# EAGLE design SlaveV1 (EAGLE 6.5.0)
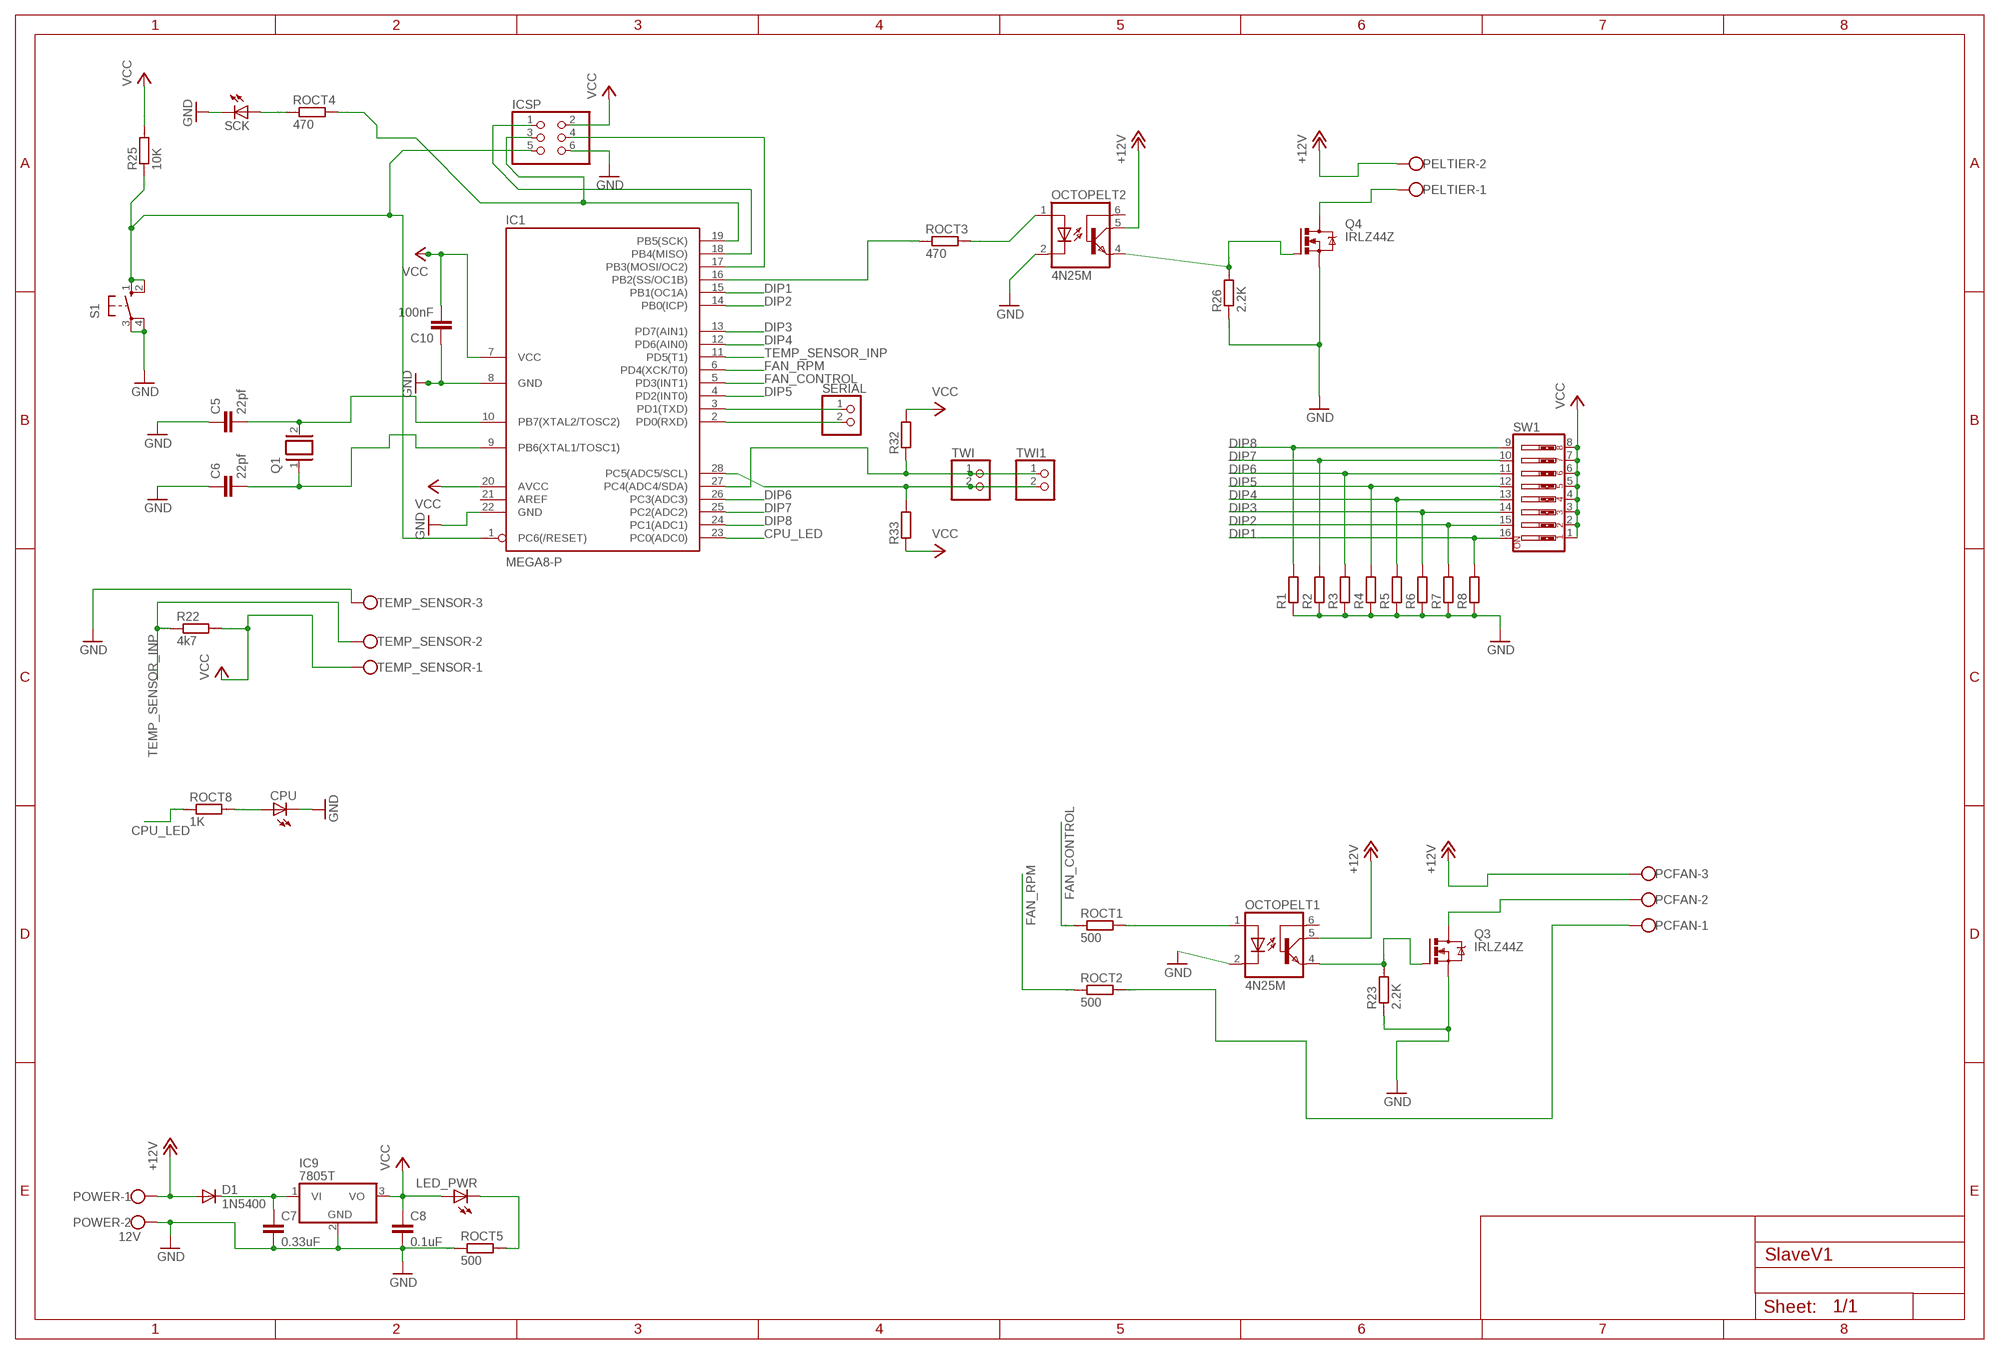
[diagram p0: schematic, sheet 1]

## Parts
C5  22pf  C2,5-3  [C2.5-3]
C6  22pf  C2,5-3  [C2.5-3]
C7  0.33uF  C2,5-3  [C2.5-3]
C8  0.1uF  C2,5-3  [C2.5-3]
C10  100nF  C2,5-3  [C2.5-3]
CPU  LED5MM  [LED5MM]
D1  1N5400  [DO201-15]
IC1  MEGA8-P  [DIL28-3]
IC9  7805T  [TO220H]
ICSP  PINHD-2X3  [2X03]
LED_PWR  LED5MM  [LED5MM]
OCTOPELT1  4N25M  [DIL06]
OCTOPELT2  4N25M  [DIL06]
PCFAN  W237-103  [W237-103]
PELTIER  W237-102  [W237-102]
POWER  12V  W237-102  [W237-102]
Q1  XTAL  [Q]
Q3  IRLZ44Z  [TO220BH]
Q4  IRLZ44Z  [TO220BH]
R1  R-EU_0207/10  [0207/10]
R2  R-EU_0207/10  [0207/10]
R3  R-EU_0207/10  [0207/10]
R4  R-EU_0207/10  [0207/10]
R5  R-EU_0207/10  [0207/10]
R6  R-EU_0207/10  [0207/10]
R7  R-EU_0207/10  [0207/10]
R8  R-EU_0207/10  [0207/10]
R22  4k7  R0204/7  [0204/7]
R23  2.2K  R0204/7  [0204/7]
R25  10K  R0204/7  [0204/7]
R26  2.2K  R0204/7  [0204/7]
R32  R-EU_0207/10  [0207/10]
R33  R-EU_0207/10  [0207/10]
ROCT1  500  R0204/7  [0204/7]
ROCT2  500  R0204/7  [0204/7]
ROCT3  470  R0204/7  [0204/7]
ROCT4  470  R0204/7  [0204/7]
ROCT5  500  R0204/7  [0204/7]
ROCT8  1K  R0204/7  [0204/7]
S1  10-XX  [B3F-10XX]
SCK  LED5MM  [LED5MM]
SERIAL  PINHD-1X2/90  [1X02/90]
SW1  SW_DIP-8  [EDG-08]
TEMP_SENSOR  W237-103  [W237-103]
TWI  PINHD-1X2/90  [1X02/90]
TWI1  PINHD-1X2/90  [1X02/90]

## Nets
+12V [+12V]: D1.A OCTOPELT1.5(COL) OCTOPELT2.5(COL) PCFAN.3 PELTIER.2 POWER.1
CPU_LED: IC1.23(PC0(ADC0)) ROCT8.1
DIP1: IC1.15(PB1(OC1A)) R8.2 SW1.16
DIP2: IC1.14(PB0(ICP)) R7.2 SW1.15
DIP3: IC1.13(PD7(AIN1)) R6.2 SW1.14
DIP4: IC1.12(PD6(AIN0)) R5.2 SW1.13
DIP5: IC1.4(PD2(INT0)) R4.2 SW1.12
DIP6: IC1.26(PC3(ADC3)) R3.2 SW1.11
DIP7: IC1.25(PC2(ADC2)) R2.2 SW1.10
DIP8: IC1.24(PC1(ADC1)) R1.2 SW1.9
FAN_CONTROL: IC1.5(PD3(INT1)) ROCT1.1
FAN_RPM: IC1.6(PD4(XCK/T0)) ROCT2.1
GND [AGND]: C5.1 C6.1 C7.2 C8.2 C10.1 CPU.K(C) IC1.8(GND) IC1.22(GND) IC9.2(GND) ICSP.6 OCTOPELT1.2(C) OCTOPELT2.2(C) POWER.2 Q3.S Q4.S R1.1 R2.1 R3.1 R4.1 R5.1 R6.1 R7.1 R8.1 R23.1 R26.1 ROCT5.1 S1.3(P) S1.4(P1) SCK.K(C) TEMP_SENSOR.3
N$1: IC1.3(PD1(TXD)) SERIAL.1
N$2: IC1.2(PD0(RXD)) SERIAL.2
N$32: C6.2 IC1.9(PB6(XTAL1/TOSC1)) Q1.1
N$33: C5.2 IC1.10(PB7(XTAL2/TOSC2)) Q1.2
N$38: OCTOPELT1.1(A) ROCT1.2
N$40: OCTOPELT1.4(EMI) Q3.G R23.2
N$41 [AGND]: PCFAN.2 Q3.D
N$43: PCFAN.1 ROCT2.2
N$47: IC1.1(PC6(/RESET)) ICSP.5 R25.1 S1.1(S) S1.2(S1)
N$48: IC1.19(PB5(SCK)) ICSP.3 ROCT4.2
N$49: IC1.17(PB3(MOSI/OC2)) ICSP.4
N$50: IC1.18(PB4(MISO)) ICSP.1
N$51: OCTOPELT2.4(EMI) Q4.G R26.2
N$52 [AGND]: PELTIER.1 Q4.D
N$54: OCTOPELT2.1(A) ROCT3.2
N$55: IC1.16(PB2(SS/OC1B)) ROCT3.1
N$56: ROCT4.1 SCK.A
N$57: C7.1 D1.C IC9.1(VI)
N$59: LED_PWR.K(C) ROCT5.2
N$63: CPU.A ROCT8.2
SCL_PIN: IC1.28(PC5(ADC5/SCL)) R33.2 TWI1.2 TWI.2
SDA_PIN: IC1.27(PC4(ADC4/SDA)) R32.1 TWI1.1 TWI.1
TEMP_SENSOR_INP: IC1.11(PD5(T1)) R22.1 TEMP_SENSOR.2
VCC: C8.1 C10.2 IC1.7(VCC) IC1.20(AVCC) IC9.3(VO) ICSP.2 LED_PWR.A R22.2 R25.2 R32.2 R33.1 SW1.1 SW1.2 SW1.3 SW1.4 SW1.5 SW1.6 SW1.7 SW1.8 TEMP_SENSOR.1
Unconnected: IC1.21(AREF) OCTOPELT1.6(BAS) OCTOPELT2.6(BAS)

## Library data of the parts
C5-C8 C10 = capacitor-wima:C: CAPACITOR naming: grid - package width
CPU LED_PWR SCK = led:LED: LED OSRAM: - CHIPLED LG R971, LG N971, LY N971, LG Q971, LY Q971, LO R971, LY R971 LH N974, LH R974 LS Q976, LO Q976, LY Q976 LO Q996 - Hyper CHIPLED LW Q18S LB Q993, LB Q99A, LB R99A - SideLED LS A670, LO A670, LY A670, LG A670, LP A670 LB A673, LV A673, LT A673, LW A673 LH A674 LY A675 LS A676, LA A676, LO A676, LY A676, LW A676 LS A679, LY A679, LG A679 - Hyper Micro SIDELED® LS Y876, LA Y876, LO Y876, LY Y876 LT Y87S - SmartLED LW L88C, LW L88S LB L89C, LB L89S, LG L890 LS L89K, LO L89K, LY L89K LS L896, LA L896, LO L896, LY L896 - TOPLED LS T670, LO T670, LY T670, LG T670, LP T670 LSG T670, LSP T670, LSY T670, LOP T670, LYG T670 LG T671, LOG T671, LSG T671 LB T673, LV T673, LT T673, LW T673 LH T674 LS T676, LA T676, LO T676, LY T676, LB T676, LH T676, LSB T676, LW T676 LB T67C, LV T67C, LT T67C, LS T67K, LO T67K, LY T67K, LW E67C LS E67B, LA E67B, LO E67B, LY E67B, LB E67C, LV E67C, LT E67C LW T67C LS T679, LY T679, LG T679 LS T770, LO T770, LY T770, LG T770, LP T770 LB T773, LV T773, LT T773, LW T773 LH T774 LS E675, LA E675, LY E675, LS T675 LS T776, LA T776, LO T776, LY T776, LB T776 LHGB T686 LT T68C, LB T68C - Hyper Mini TOPLED® LB M676 - Mini TOPLED Santana® LG M470 LS M47K, LO M47K, LY M47K Source: http://www.osram.convergy.de LUXEON: - LUMILED® LXK2-PW12-R00, LXK2-PW12-S00, LXK2-PW14-U00, LXK2-PW14-V00 LXK2-PM12-R00, LXK2-PM12-S00, LXK2-PM14-U00 LXK2-PE12-Q00, LXK2-PE12-R00, LXK2-PE12-S00, LXK2-PE14-T00, LXK2-PE14-U00 LXK2-PB12-K00, LXK2-PB12-L00, LXK2-PB12-M00, LXK2-PB14-N00, LXK2-PB14-P00, LXK2-PB14-Q00 LXK2-PR12-L00, LXK2-PR12-M00, LXK2-PR14-Q00, LXK2-PR14-R00 LXK2-PD12-Q00, LXK2-PD12-R00, LXK2-PD12-S00 LXK2-PH12-R00, LXK2-PH12-S00 LXK2-PL12-P00, LXK2-PL12-Q00, LXK2-PL12-R00 Source: www.luxeon.com KINGBRIGHT: KA-3528ASYC Source: www.kingbright.com
D1 = diode:1N5400: DIODE standard rectifier, 3 A, 50 V (Motorola)
IC1 = atmel:MEGA8-P: MICROCONTROLLER 8 Kbytes FLASH, 1 kbytes SRAM, 512 bytes EEPROM, USART, 4-channel 10 bit ADC, 2-channel 8 bit ADC Pin compatible with Atmega48, ATMega88, ATMega168 Source: avr.lbr; OC_FARNELL: unknown; OC_NEWARK: unknown
IC9 = linear:78*: Positive VOLTAGE REGULATOR Source: http://cache.national.com/ds/LM/LM78L05.pdf http://www.fairchildsemi.com/ds/LM/LM7805.pdf
ICSP = pinhead:PINHD-2X3: PIN HEADER
OCTOPELT1 OCTOPELT2 = optocoupler:4N*?M: General Purpose 6-Pin Phototransistor Optocouplers Source: http://www.fairchildsemi.com/ds/4N/4N35-M.pdf; MPN: 4N25-M; OC_FARNELL: 1021349; OC_NEWARK: 98K9084
PCFAN TEMP_SENSOR = con-wago-500:W237-103: WAGO SCREW CLAMP; MPN: 237-103; OC_FARNELL: unknown; OC_NEWARK: 18M7116
PELTIER POWER = con-wago-500:W237-102: WAGO SCREW CLAMP; MPN: 237-102; OC_FARNELL: unknown; OC_NEWARK: 70K9898
Q1 = special:XTAL: CRYSTAL
Q3 Q4 = transistor-power:IRLZ44Z: N-Channel HEXFET® Power MOSFET Logic Level AUTOMOTIVE MOSFET Source: http://www.irf.com/product-info/datasheets/data/irlz44zpbf.pdf
R1-R8 R32 R33 = rcl:R-EU_: RESISTOR, European symbol
R22 R23 R25 R26 ROCT1-ROCT5 ROCT8 = eagle-ltspice:R: RESISTOR, European symbol; SPICEMODEL: NONE; SPICEPREFIX: R
S1 = switch-omron:10-XX: OMRON SWITCH; MPN: B3F-1000; OC_FARNELL: 176432; OC_NEWARK: 36M3542
SERIAL TWI TWI1 = pinhead:PINHD-1X2: PIN HEADER
SW1 = special:SW_DIP-8: DIP SWITCH

## Net classes
0 default: clearance 0.205 mm
1 +12V: width 1 mm, clearance 0.205 mm to class 0, clearance 1 mm
2 AGND: width 1 mm, clearance 0.205 mm to class 0, clearance 0.205 mm to class 1, clearance 1 mm

## Board
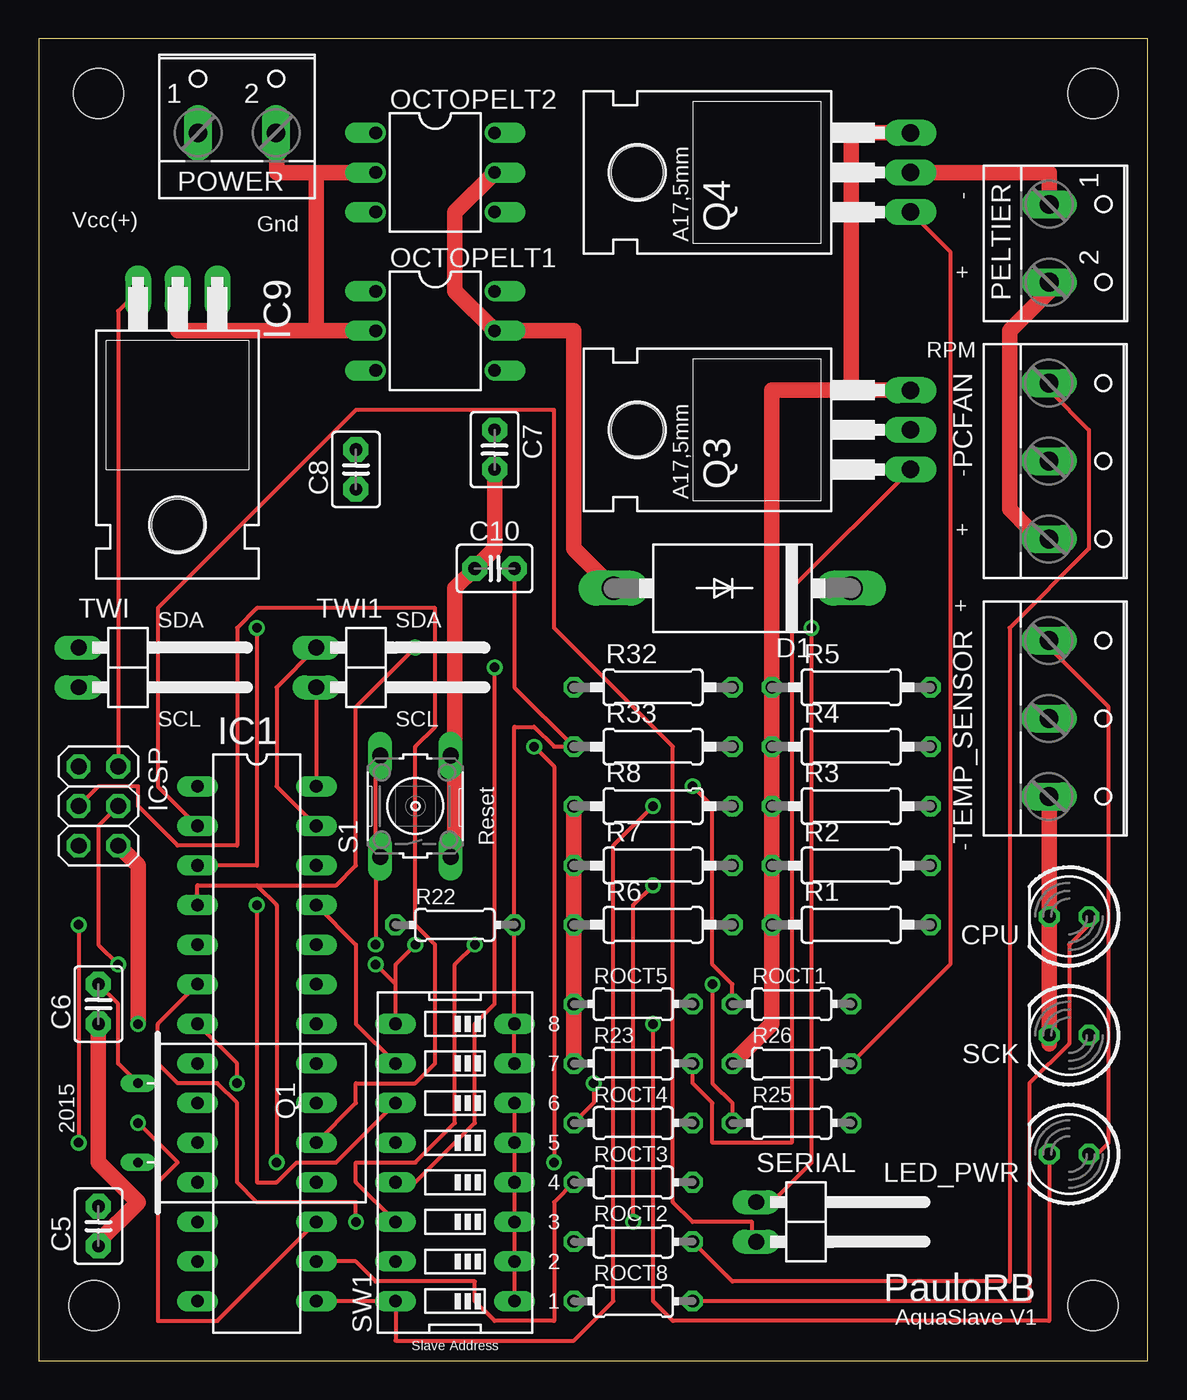
[diagram p1: board, top side]
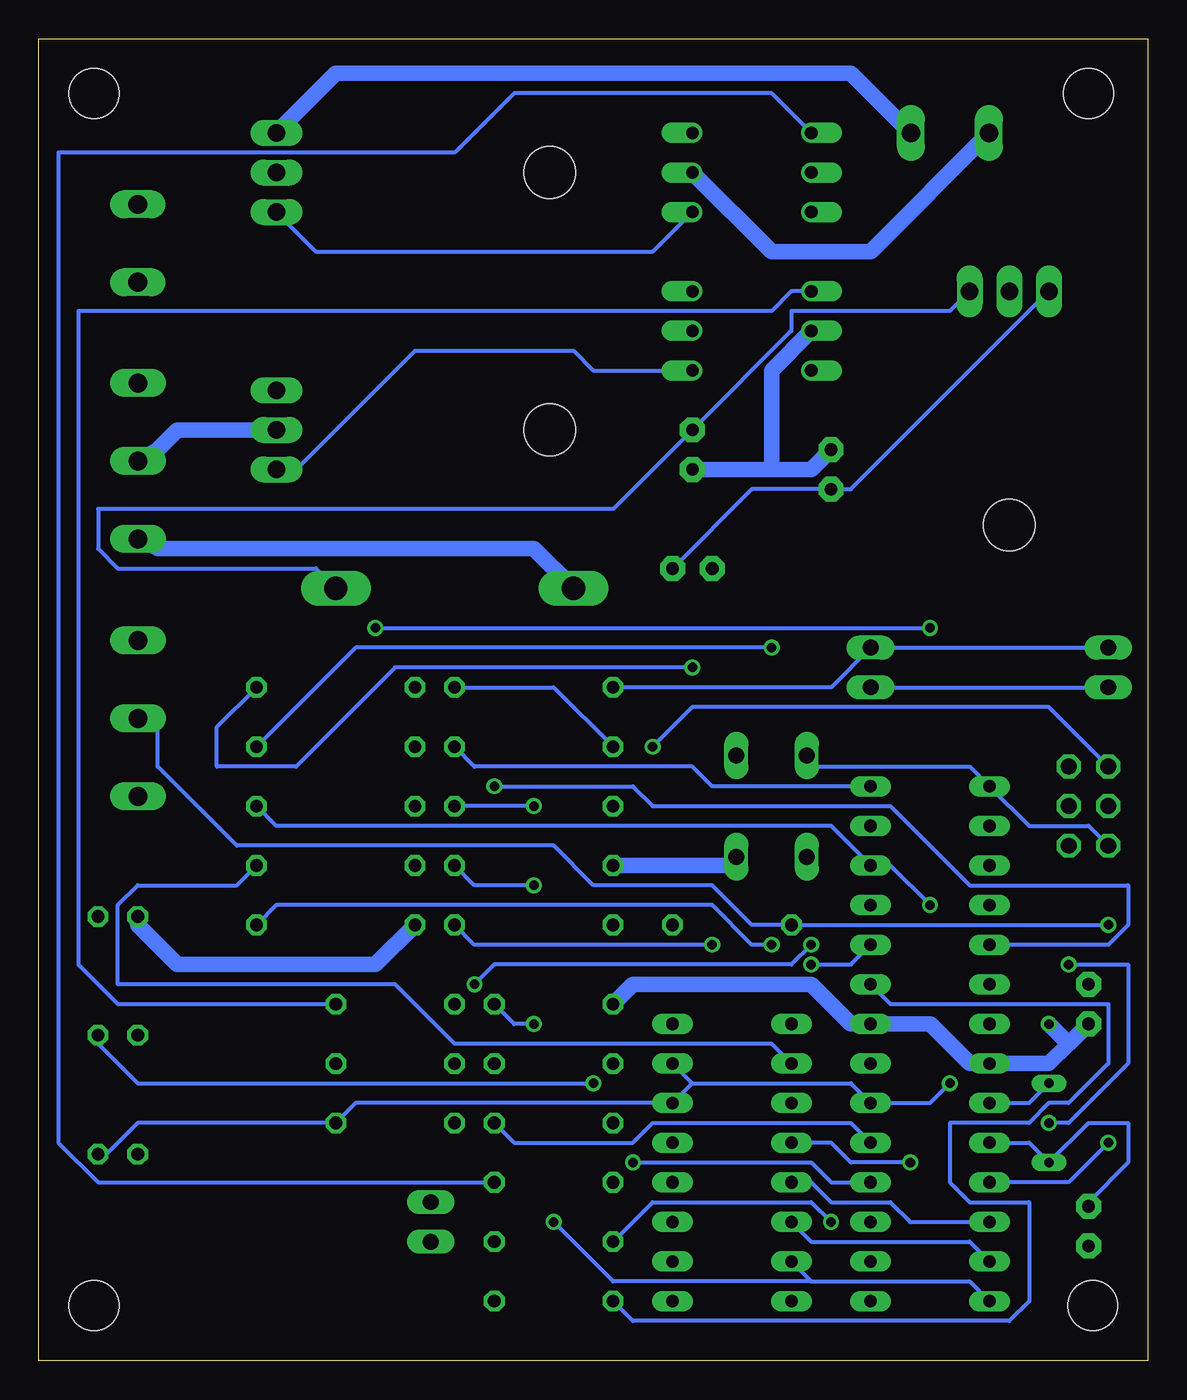
[diagram p2: board, bottom side, seen from below]

Size 71.1 x 84.76 mm. Coordinates in mm from the lower left corner, seen from the top.
Outline: 0,0 71.1,0 71.1,84.76 0,84.76 0,0
Copper layers (1*16): Top 0.035mm / dielectric 1.5mm / Bottom 0.035mm
Design rules "default": minimum track width 10mil, minimum drill 24mil, track to track 8mil, track to pad 8mil, pad to pad 8mil, via to via 8mil, smd to smd 8mil, copper to edge 40mil, drill to drill 8mil, minimum pad ring 10mil, minimum via ring 8mil, stop-mask expansion 4mil, vias tented up to drill 0mil, thermal gap 10mil
Holes 3.2 mm at 67.58,3.54 3.54,3.54 3.81,81.28 67.58,81.28
tKeepout: area 54.5,77.3 to 57.3,77.5; area 54.4,74.9 to 57.3,75.1
bKeepout: area 54.5,77.3 to 57.3,77.5
tRestrict: area 54.7,60.8 to 57.4,61.1; area 54.6,58.3 to 57.2,58.5
bRestrict: area 54.6,58.3 to 57.2,58.5; area 54.7,60.9 to 57.4,61.1

### Footprints (pad centres in the part's own frame; a part is rotated, then mirrored left to right if it is on the bottom)
C2.5-3 = drill 0.813 pad 1.6 octagon: 1 -1.27,0; 2 1.27,0
LED5MM = drill 0.813 octagon: A -1.27,0; K 1.27,0
DO201-15 = drill 1.499 long: A 7.62,0; C -7.62,0
DIL28-3 = drill 0.813 long: 1 -16.51,-3.81; 2 -13.97,-3.81; 3 -11.43,-3.81; 4 -8.89,-3.81; 5 -6.35,-3.81; 6 -3.81,-3.81; 7 -1.27,-3.81; 8 1.27,-3.81; 9 3.81,-3.81; 10 6.35,-3.81; 11 8.89,-3.81; 12 11.43,-3.81; 13 13.97,-3.81; 14 16.51,-3.81; 15 16.51,3.81; 16 13.97,3.81; 17 11.43,3.81; 18 8.89,3.81; 19 6.35,3.81; 20 3.81,3.81; 21 1.27,3.81; 22 -1.27,3.81; 23 -3.81,3.81; 24 -6.35,3.81; 25 -8.89,3.81; 26 -11.43,3.81; 27 -13.97,3.81; 28 -16.51,3.81
TO220H = drill 1.118 long: 1 -2.54,-10.16; 2 0,-10.16; 3 2.54,-10.16 | hole 3.302: 0,4.826
2X03 = drill 1.016 octagon: 1 -2.54,-1.27; 2 -2.54,1.27; 3 0,-1.27; 4 0,1.27; 5 2.54,-1.27; 6 2.54,1.27
DIL06 = drill 0.813 offset: 1 -2.54,-3.81; 2 0,-3.81; 3 2.54,-3.81; 4 2.54,3.81; 5 0,3.81; 6 -2.54,3.81
W237-103 = drill 1.194 long: 1 -5,-1.29; 2 0,-1.29; 3 5,-1.29
W237-102 = drill 1.194 long: 1 -2.5,-1.27; 2 2.5,-1.27
Q = drill 0.61 long: 1 -2.54,-7.62; 2 2.54,-7.62
TO220BH = drill 1.118 long: D 0,-6.35; G -2.54,-6.35; S 2.54,-6.35 | hole 3.302: 0,11.176
0207/10 = drill 0.813 octagon: 1 -5.08,0; 2 5.08,0
0204/7 = drill 0.813 octagon: 1 -3.81,0; 2 3.81,0
B3F-10XX = drill 1.016 long: 1 -3.251,2.261; 2 3.251,2.261; 3 -3.251,-2.261; 4 3.251,-2.261
1X02/90 = drill 1.016 long: 1 -1.27,-3.81; 2 1.27,-3.81
EDG-08 = drill 0.813 long: 1 -8.89,-3.81; 2 -6.35,-3.81; 3 -3.81,-3.81; 4 -1.27,-3.81; 5 1.27,-3.81; 6 3.81,-3.81; 7 6.35,-3.81; 8 8.89,-3.81; 9 8.89,3.81; 10 6.35,3.81; 11 3.81,3.81; 12 1.27,3.81; 13 -1.27,3.81; 14 -3.81,3.81; 15 -6.35,3.81; 16 -8.89,3.81

### Placement (x,y rotation side)
C5  3.81,8.62 90 top
C6  3.81,22.86 90 top
C7  29.21,58.42 270 top
C8  20.32,57.15 90 top
C10  29.21,50.8 0 top
CPU  66.04,28.48 180 top
D1  44.45,49.53 180 top
IC1  13.97,20.32 270 top
IC9  8.89,58.42 180 top
ICSP  3.81,35.56 270 top
LED_PWR  66.04,13.24 180 top
OCTOPELT1  25.4,66.04 270 top
OCTOPELT2  25.4,76.2 270 top
PCFAN  66.04,57.69 270 top
PELTIER  66.04,71.66 270 top
POWER  12.7,80.01 0 top
Q1  13.97,15.24 270 top
Q3  49.53,59.69 90 top
Q4  49.53,76.2 90 top
R1  52.07,27.94 0 top
R2  52.07,31.75 0 top
R3  52.07,35.56 0 top
R4  52.07,39.37 0 top
R5  52.07,43.18 0 top
R6  39.37,27.94 0 top
R7  39.37,31.75 0 top
R8  39.37,35.56 0 top
R22  26.67,27.94 0 top
R23  38.1,19.05 0 top
R25  48.26,15.24 0 top
R26  48.26,19.05 0 top
R32  39.37,43.18 0 top
R33  39.37,39.37 0 top
ROCT1  48.26,22.86 0 top
ROCT2  38.1,7.62 0 top
ROCT3  38.1,11.43 0 top
ROCT4  38.1,15.24 0 top
ROCT5  38.1,22.86 0 top
ROCT8  38.1,3.81 0 top
S1  24.13,35.56 90 top
SCK  66.04,20.86 180 top
SERIAL  49.8,8.89 270 top
SW1  26.67,12.7 90 top
TEMP_SENSOR  66.04,41.18 270 top
TWI  6.35,44.45 270 top
TWI1  21.59,44.45 270 top

### Tracks (layer width: path | path; a pad name or v marks a point on that pad's centre or on a via)
+12V
  Top 1: OCTOPELT2.5 26.67,73.66 26.67,68.58 OCTOPELT1.5 34.29,66.04 34.29,52.07 D1.A | PCFAN.3 63.5,53.34 62.23,54.61 62.23,66.04 64.77,68.58 PELTIER.2
  Bottom 1: OCTOPELT2.5 24.13,71.12 17.78,71.12 10.16,78.74 POWER.1 | D1.A 39.37,52.07 63.5,52.07 PCFAN.3
CPU_LED
  Bottom 0.254: ROCT8.1 33.02,2.54 8.89,2.54 7.62,3.81 7.62,10.16 11.43,10.16 12.7,11.43 12.7,15.24 7.62,15.24 6.35,16.51 5.08,16.51 2.54,19.05 2.54,22.86 16.51,22.86 IC1.23
DIP1  (via drill 0.61)
  Top 0.254: IC1.15 SW1.16 22.86,1.27 34.29,1.27 36.83,3.81 36.83,33.02 v39.37,35.56
  Bottom 0.254: v39.37,35.56 R8.2
DIP2  (via drill 0.61)
  Top 0.254: v39.37,30.48 38.1,29.21 v38.1,8.89
  Bottom 0.254: IC1.14 11.43,5.08 21.59,5.08 | SW1.15 21.59,5.08 | R7.2 43.18,30.48 v39.37,30.48 | v38.1,8.89 34.29,5.08 21.59,5.08
DIP3  (via drill 0.61)
  Top 0.254: v27.94,26.67 26.67,25.4 26.67,15.24 24.13,12.7 20.32,12.7 20.32,11.43 SW1.14
  Bottom 0.254: IC1.13 11.43,7.62 21.59,7.62 SW1.14 | R6.2 43.18,26.67 v27.94,26.67
DIP4  (via drill 0.61)
  Top 0.254: v29.21,44.45 29.21,22.86 27.94,21.59 27.94,15.24 24.13,11.43 SW1.13
  Bottom 0.254: IC1.12 15.24,8.89 16.51,10.16 20.32,10.16 21.59,11.43 SW1.13 | R5.2 59.69,40.64 59.69,38.1 54.61,38.1 48.26,44.45 v29.21,44.45
DIP5  (via drill 0.61)
  Top 0.254: v15.24,12.7 15.24,29.21 13.97,30.48 | 13.97,30.48 10.16,30.48 IC1.4 | v24.13,45.72 20.32,41.91 20.32,31.75 19.05,30.48 13.97,30.48
  Bottom 0.254: SW1.12 20.32,13.97 19.05,12.7 v15.24,12.7 | R4.2 50.8,45.72 v24.13,45.72
DIP6  (via drill 0.61)
  Top 0.254: SW1.11 19.05,12.7 16.51,12.7 15.24,11.43 13.97,11.43 v13.97,29.21
  Bottom 0.254: v13.97,29.21 16.51,31.75 IC1.26 20.32,34.29 55.88,34.29 R3.2
DIP7
  Top 0.254: SW1.10 20.32,21.59 20.32,26.67 IC1.25
  Bottom 0.254: R2.2 58.42,30.48 64.77,30.48 66.04,29.21 66.04,24.13 48.26,24.13 44.45,20.32 24.13,20.32 SW1.10
DIP8  (via drill 0.61)
  Top 0.254: 22.86,24.13 v21.59,25.4 | SW1.9 22.86,24.13 | v24.13,26.67 22.86,25.4 22.86,24.13
  Bottom 0.254: IC1.24 19.05,25.4 v21.59,25.4 | R1.2 55.88,29.21 27.94,29.21 25.4,26.67 v24.13,26.67
FAN_CONTROL  (via drill 0.61)
  Top 0.254: v41.91,36.83 43.18,35.56 43.18,25.4 44.45,24.13 ROCT1.1
  Bottom 0.254: IC1.5 2.54,26.67 1.27,27.94 1.27,30.48 11.43,30.48 16.51,35.56 31.75,35.56 33.02,36.83 v41.91,36.83
FAN_RPM  (via drill 0.61)
  Top 0.254: IC1.6 7.62,21.59 7.62,19.05 8.89,17.78 11.43,17.78 12.7,16.51 12.7,11.43 13.97,10.16 20.32,10.16 v20.32,8.89
  Bottom 0.254: v20.32,8.89 21.59,10.16 31.75,10.16 ROCT2.1
GND  (via drill 0.61)
  Top 1: 64.77,20.32 SCK.K 64.77,27.94 CPU.K 64.77,35.56 TEMP_SENSOR.3 | R26.1 46.99,21.59 R1.1 R2.1 R3.1 R4.1 R5.1 46.99,62.23 52.07,62.23 | 52.07,62.23 Q3.S | Q4.S 52.07,78.74 52.07,62.23 | ICSP.6 6.35,31.75 v6.35,21.59 | C6.1 3.81,12.7 6.35,10.16 3.81,7.62 C5.1 | 17.78,76.2 15.24,76.2 15.24,78.74 POWER.2 | 17.78,76.2 OCTOPELT2.2 | 17.78,66.04 8.89,66.04 IC9.2 | 17.78,66.04 OCTOPELT1.2 | 17.78,66.04 17.78,76.2 | C7.2 29.21,52.07 C10.1 26.67,49.53 26.67,39.37 S1.4 26.67,38.1 26.67,33.02 S1.3 | R23.1 ROCT5.1 R6.1 R7.1 R8.1
  Bottom 1: R1.1 49.53,25.4 62.23,25.4 64.77,27.94 CPU.K | C6.1 5.08,20.32 | 5.08,20.32 6.35,19.05 IC1.8 11.43,19.05 13.97,21.59 IC1.22 19.05,21.59 21.59,24.13 33.02,24.13 ROCT5.1 | 5.08,20.32 v6.35,21.59 | C8.2 21.59,57.15 24.13,57.15 | C7.2 24.13,57.15 | R7.1 26.67,31.75 S1.3 | OCTOPELT1.2 24.13,63.5 24.13,57.15 | Q4.S 52.07,82.55 19.05,82.55 15.24,78.74 POWER.2
N$1  (via drill 0.61)
  Top 0.254: IC1.3 13.97,31.75 v13.97,46.99 | v49.53,46.99 49.53,12.7 46.99,10.16 SERIAL.1
  Bottom 0.254: v49.53,46.99 v13.97,46.99
N$2
  Top 0.254: IC1.2 7.62,36.83 7.62,48.26 20.32,60.96 33.02,60.96 33.02,46.99 40.64,39.37 40.64,10.16 41.91,8.89 45.72,8.89 45.72,7.62 SERIAL.2
N$32
  Top 0.254: C6.2 5.08,22.86 5.08,19.05 Q1.1
  Bottom 0.254: Q1.1 7.62,16.51 IC1.9
N$33
  Bottom 0.254: IC1.10 7.62,13.97 Q1.2 3.81,15.24 1.27,15.24 1.27,12.7 3.81,10.16 C5.2
N$38
  Bottom 0.254: ROCT1.2 66.04,22.86 68.58,25.4 68.58,67.31 24.13,67.31 22.86,68.58 OCTOPELT1.1
N$40
  Top 0.254: R23.2 41.91,17.78 43.18,16.51 43.18,13.97 48.26,13.97 48.26,49.53 Q3.G
  Bottom 0.254: OCTOPELT1.4 35.56,63.5 36.83,64.77 46.99,64.77 54.61,57.15 Q3.G
N$41
  Bottom 1: Q3.D 62.23,59.69 63.5,58.42 PCFAN.2
N$43
  Top 0.254: ROCT2.2 44.45,5.08 62.23,5.08 62.23,46.99 67.31,52.07 67.31,59.69 64.77,62.23 PCFAN.1
N$47  (via drill 0.61)
  Top 0.254: R25.1 44.45,16.51 43.18,17.78 v43.18,24.13 | v21.59,26.67 21.59,31.75 S1.1 21.59,33.02 21.59,38.1 S1.2
  Bottom 0.254: S1.2 21.59,38.1 11.43,38.1 IC1.1 7.62,34.29 3.81,34.29 ICSP.5 | v43.18,24.13 41.91,25.4 22.86,25.4 v21.59,26.67
N$48
  Top 0.254: ICSP.3 3.81,36.83 6.35,36.83 6.35,35.56 8.89,33.02 12.7,33.02 12.7,46.99 13.97,48.26 25.4,48.26 25.4,40.64 24.13,39.37 24.13,27.94 25.4,26.67 25.4,19.05 24.13,17.78 20.32,17.78 20.32,16.51 IC1.19
  Bottom 0.254: IC1.19 19.05,15.24 31.75,15.24 33.02,13.97 40.64,13.97 ROCT4.2
N$49  (via drill 0.61)
  Top 0.254: IC1.17 11.43,2.54 7.62,2.54 7.62,11.43 8.89,12.7 v6.35,15.24 | v5.08,25.4 3.81,26.67 3.81,34.29 ICSP.4
  Bottom 0.254: v6.35,15.24 5.08,15.24 1.27,19.05 1.27,25.4 v5.08,25.4
N$50  (via drill 0.61)
  Top 0.254: v33.02,12.7 33.02,38.1 v31.75,39.37
  Bottom 0.254: IC1.18 20.32,11.43 21.59,12.7 v33.02,12.7 | v31.75,39.37 29.21,41.91 6.35,41.91 ICSP.1
N$51
  Top 0.254: R26.2 58.42,25.4 58.42,71.12 Q4.G
  Bottom 0.254: OCTOPELT2.4 31.75,71.12 53.34,71.12 Q4.G
N$52
  Top 1: Q4.D 64.77,76.2 PELTIER.1
N$54
  Bottom 0.254: ROCT3.2 67.31,11.43 69.85,13.97 69.85,77.47 44.45,77.47 40.64,81.28 24.13,81.28 OCTOPELT2.1
N$55
  Top 0.254: IC1.16 20.32,6.35 21.59,5.08 27.94,5.08 27.94,3.81 29.21,2.54 33.02,2.54 33.02,10.16 ROCT3.1
N$56  (via drill 0.61)
  Top 0.254: ROCT4.1 35.56,16.51 v35.56,17.78
  Bottom 0.254: v35.56,17.78 64.77,17.78 67.31,20.32 SCK.A
N$57
  Bottom 0.254: IC9.1 12.7,67.31 22.86,67.31 22.86,66.04 C7.1 34.29,54.61 67.31,54.61 67.31,52.07 66.04,50.8 53.34,50.8 D1.C
N$59  (via drill 0.61)
  Top 0.254: v39.37,21.59 39.37,3.81 40.64,2.54 64.77,2.54 LED_PWR.K
  Bottom 0.254: ROCT5.2 40.64,21.59 v39.37,21.59
N$63
  Top 0.254: ROCT8.2 63.5,3.81 63.5,17.78 66.04,20.32 66.04,26.67 67.31,27.94 CPU.A
SCL_PIN
  Top 0.254: TWI1.2 IC1.28
  Bottom 0.254: R33.2 43.18,38.1 29.21,38.1 27.94,36.83 IC1.28 | TWI1.2 TWI.2
SDA_PIN
  Top 0.254: IC1.27 15.24,36.83 15.24,43.18 TWI1.1
  Bottom 0.254: R32.1 20.32,43.18 TWI1.1 TWI.1
TEMP_SENSOR_INP  (via drill 0.61)
  Top 0.254: v2.54,27.94 v2.54,13.97
  Bottom 0.254: IC1.11 5.08,11.43 v2.54,13.97 | v2.54,27.94 R22.1 25.4,27.94 27.94,30.48 35.56,30.48 38.1,33.02 58.42,33.02 63.5,38.1 63.5,40.64 TEMP_SENSOR.2
VCC  (via drill 0.61)
  Top 0.254: ICSP.2 5.08,67.31 IC9.3 | C10.2 30.48,43.18 R33.1 33.02,39.37 31.75,40.64 30.48,40.64 R22.2 SW1.8 SW1.7 | IC1.7 12.7,19.05 v12.7,17.78 | SW1.1 SW1.2 SW1.3 SW1.4 SW1.5 SW1.6 | TEMP_SENSOR.1 64.77,45.72 68.58,41.91 68.58,13.97 67.31,12.7 LED_PWR.A
  Bottom 0.254: R33.1 38.1,43.18 R32.2 | C10.2 25.4,55.88 C8.1 19.05,55.88 IC9.3 | 29.21,17.78 19.05,17.78 IC1.20 13.97,16.51 v12.7,17.78 | SW1.7 29.21,17.78 | LED_PWR.A 67.31,12.7 64.77,15.24 R25.2 50.8,16.51 SW1.6 29.21,17.78

### Text on the board
tPlace: Vcc(+) | - | Gnd | + | RPM | - | + | + | SDA | SDA | SCL | SCL | Reset | - | 8 | 7 | 2015 | 6 | 5 | 4 | 3 | 2 | 1 | PauloRB | AquaSlave V1 | Slave Address